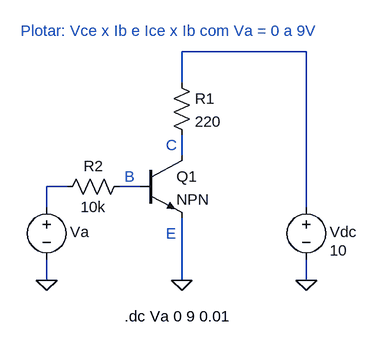
[diagram p0: schematic curva_npn_BC547C.asc]
curva_npn_BC547C.asc, the LTspice schematic file:
Version 4
SHEET 1 1032 680
WIRE 304 -160 112 -160
WIRE 112 -112 112 -160
WIRE 112 0 112 -32
WIRE -64 48 -96 48
WIRE 48 48 16 48
WIRE -96 80 -96 48
WIRE 304 80 304 -160
WIRE -96 192 -96 160
WIRE 112 192 112 96
WIRE 304 192 304 160
FLAG -96 192 0
FLAG 112 192 0
FLAG 304 192 0
SYMBOL voltage -96 64 R0
WINDOW 0 36 54 Left 2
WINDOW 123 0 0 Left 2
WINDOW 39 36 82 Left 2
WINDOW 3 24 96 Invisible 2
SYMATTR InstName Va
SYMATTR Value 0
SYMBOL res 96 -128 R0
SYMATTR InstName R1
SYMATTR Value 220
SYMBOL voltage 304 64 R0
WINDOW 0 36 54 Left 2
WINDOW 123 0 0 Left 2
WINDOW 39 36 82 Left 2
WINDOW 3 36 82 Left 2
SYMATTR InstName Vdc
SYMATTR Value 10
SYMBOL res -80 64 R270
WINDOW 0 32 56 VTop 2
WINDOW 3 0 56 VBottom 2
SYMATTR InstName R2
SYMATTR Value 10k
SYMBOL npn 48 0 R0
SYMATTR InstName Q1
TEXT 24 248 Left 2 !.dc Va 0 9 0.01
TEXT -136 -192 Left 2 ;Plotar: Vce x Ib e Ice x Ib com Va = 0 a 9V
TEXT 88 -16 Left 2 ;C
TEXT 24 32 Left 2 ;B
TEXT 88 120 Left 2 ;E

The netlist it stands for:
* curva_npn_BC547C.asc
Va N003 0 0
R1 N001 N002 220
Vdc N001 0 10
R2 N003 N004 10k
Q1 N002 N004 0 0 NPN
.model NPN NPN
.model PNP PNP
.lib standard.bjt
.dc Va 0 9 0.01
* Plotar: Vce x Ib e Ice x Ib com Va = 0 a 9V
* C
* B
* E
.backanno
.end